# EasyEDA schematic schematic.json
TITLE: Sheet_1; REV: 1.0; Date: 2020-02-24; Sheet: 1/1; Drawn By: saikek; Company: Your Company
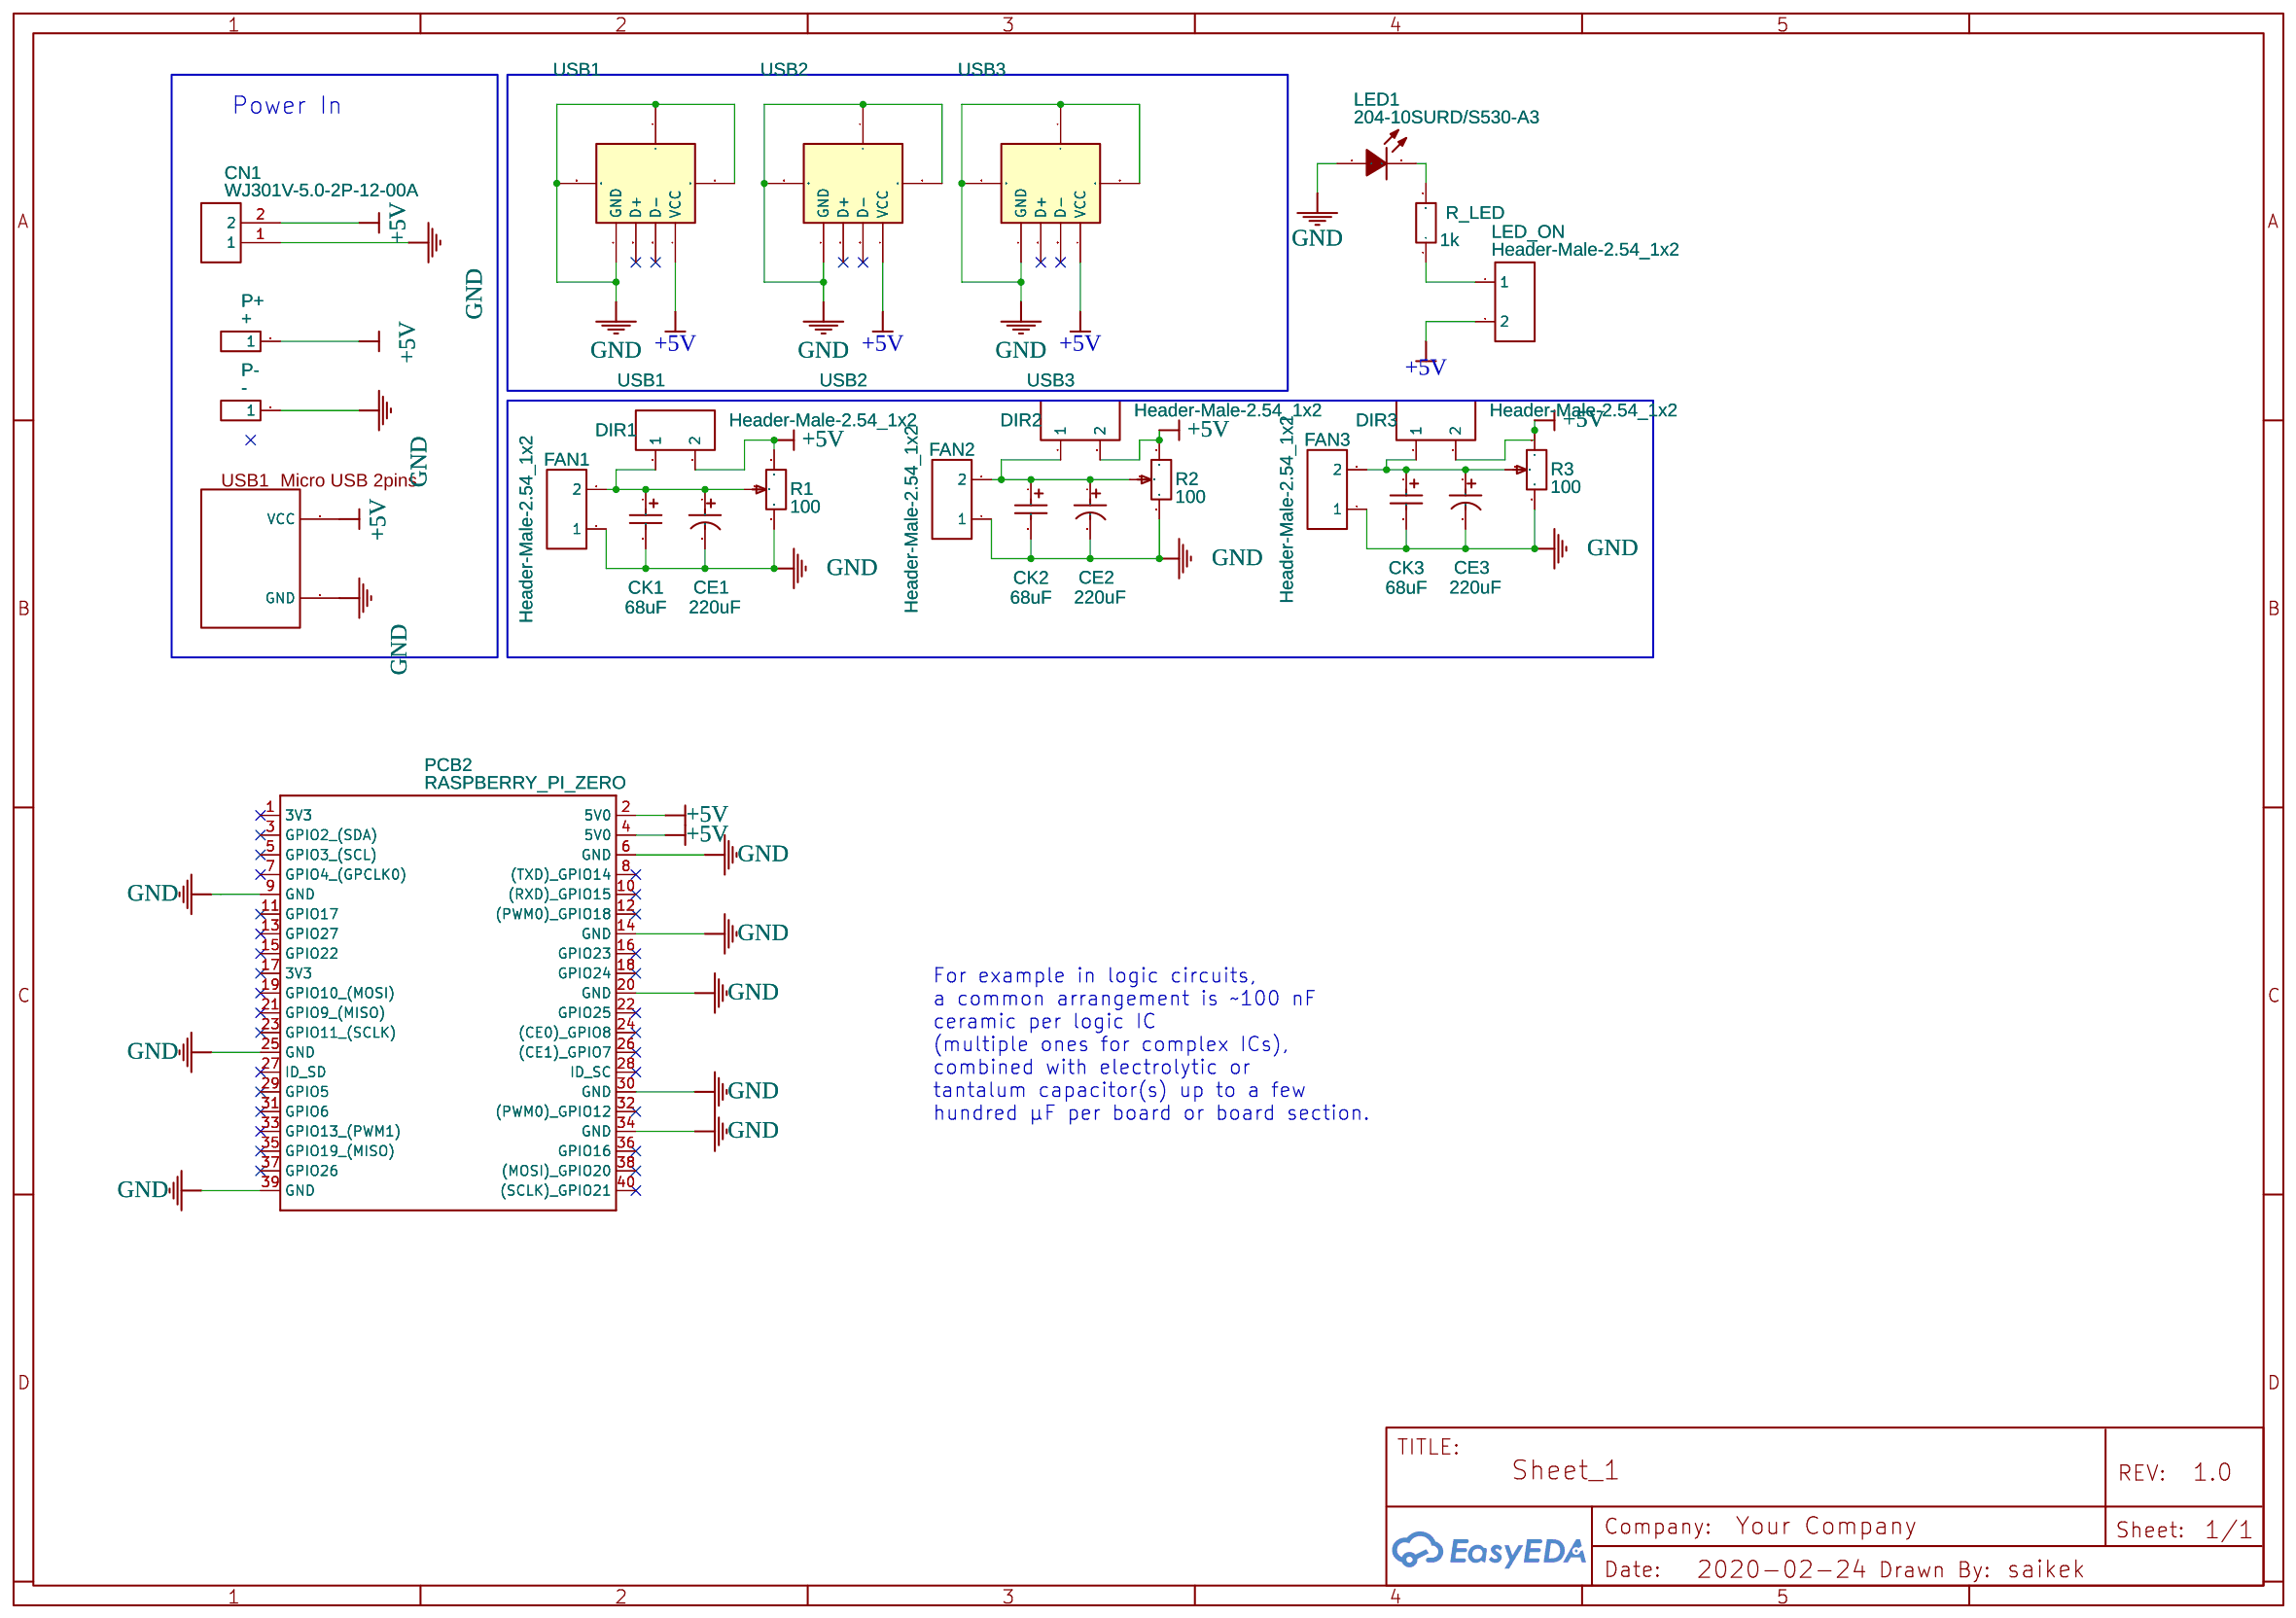
[diagram p0: schematic sheet]

## Parts
CE1  220uF  [CAP-TH_BD6.3-P2.50-D1.0-FD]
CE2  220uF  [CAP-TH_BD6.3-P2.50-D1.0-FD]
CE3  220uF  [CAP-TH_BD6.3-P2.50-D1.0-FD]
CK1  68uF  [CAP-SMD_L6.0-W3.2]
CK2  68uF  [CAP-SMD_L6.0-W3.2]
CK3  68uF  [CAP-SMD_L6.0-W3.2]
CN1  WJ301V-5.0-2P-12-00A  [WJ301V-5.0-2P-12-00A]
DIR1  Header-Male-2.54_1x2  [HDR-2X1/2.54]
DIR2  Header-Male-2.54_1x2  [HDR-2X1/2.54]
DIR3  Header-Male-2.54_1x2  [HDR-2X1/2.54]
FAN1  Header-Male-2.54_1x2  [HDR-2X1/2.54]
FAN2  Header-Male-2.54_1x2  [HDR-2X1/2.54]
FAN3  Header-Male-2.54_1x2  [HDR-2X1/2.54]
LED1  204-10SURD/S530-A3  [LED-3MM/2.54]
LED_ON  Header-Male-2.54_1x2  [HDR-2X1/2.54]
P+  +  [PAD-SMD-R150]
P-  -  [PAD-SMD-R150]
PCB2  RASPBERRY_PI_ZERO  [RASPBERRY PI ZERO (FACE UP) OUTLINE]
R1  100  [RES-ADJ-TH_3296X]
R2  100  [RES-ADJ-TH_3296X]
R3  100  [RES-ADJ-TH_3296X]
R_LED  1k  [1206]
U2  MicroUSB 2 pins female  [USB 2 PIN FEMALE]
USB1  USB1  [USB-A-TH_4P-P1.40-V-F-C39451]
USB2  USB2  [USB-A-TH_4P-P1.40-V-F-C39451]
USB3  USB3  [USB-A-TH_4P-P1.40-V-F-C39451]

## Library data of the parts
CE1-CE3 = 220uF 16V 6.3*11: Supplier: LCSC; Manufacturer: ValuePro; Supplier Part: C43349
CK1-CK3 = TAJC686K016RNJ: Supplier: LCSC; Manufacturer: AVX; Supplier Part: C7220; LCSC Assembly: Yes; SMT Type: Extend
CN1 = -: Supplier Part: C8475; Supplier: LCSC; Manufacturer: ReliaPro; Manufacturer Part: WJ301V-5.0-2P
DIR1-DIR3 FAN1-FAN3 = -: Supplier: LCSC; Manufacturer: TE Connectivity; Manufacturer Part: 826629-2; image: //image.lceda.cn/szlcsc/C86471.jpg; Supplier Part: C225488
LED1 = 204-10SURD/S530-A3: Supplier: LCSC; Manufacturer: EVERLIGHT; Supplier Part: C99772
LED_ON = Header-Male-2.54_1x2: Supplier: LCSC; Manufacturer: TE Connectivity; Manufacturer Part: 826629-2; image: //image.lceda.cn/szlcsc/C86471.jpg; Supplier Part: C86471
P+ P- = -: Supplier: LCSC; Manufacturer: ReliaPro; Manufacturer Part: Header-Male-2.54_1x1; Supplier Part: C81276
PCB2 = -: Raspberry Pi Zero; sourceId: a8qICUO6o; Manufacturer Part: ?
R1-R3 = 3296X-1-101LF: Supplier: LCSC; Manufacturer: BOURNS; Supplier Part: C92220
R_LED = Res_1206(1/4W)_EU
U2 = -: Contributor: CyberneticsCore
USB1-USB3 = AF 10.0 Side insert 3 Boundless iron PBT White plastic 90degree: Supplier: LCSC; Manufacturer: ValuePro; image: //image.lceda.cn/szlcsc/C39451.jpg; Supplier Part: C39451

## Nets
+5V: CN1.2 DIR1.2 DIR2.2 DIR3.2 LED_ON.2 P+.1 PCB2.2(5V0) PCB2.4(5V0) R1.1 R2.1 R3.1 U2.2(VCC) USB1.4(VCC) USB2.4(VCC) USB3.4(VCC)
GND: CE1.2 CE2.2 CE3.2 CK1.2 CK2.2 CK3.2 CN1.1 FAN1.1 FAN2.1 FAN3.1 LED1.1(A) P-.1 PCB2.6(GND) PCB2.9(GND) PCB2.14(GND) PCB2.20(GND) PCB2.25(GND) PCB2.30(GND) PCB2.34(GND) PCB2.39(GND) R1.3 R2.3 R3.3 U2.1(GND) USB1.1(GND) USB1.5 USB1.6 USB1.7 USB2.1(GND) USB2.5 USB2.6 USB2.7 USB3.1(GND) USB3.5 USB3.6 USB3.7
Net-(CE1-1): CE1.1 CK1.1 DIR1.1 FAN1.2 R1.2
Net-(CE2-1): CE2.1 CK2.1 DIR2.1 FAN2.2 R2.2
Net-(CE3-1): CE3.1 CK3.1 DIR3.1 FAN3.2 R3.2
Net-(LED1-2): LED1.2(K) R_LED.2
Net-(LED_ON-1): LED_ON.1 R_LED.1

Not connected (* = marked no-connect by the designer): PCB2 1(3V3)* 3(GPIO2 (SDA))* 5(GPIO3 (SCL))* 7(GPIO4 (GPCLK0))* 8((TXD) GPIO14)* 10((RXD) GPIO15)* 11(GPIO17)* 12((PWM0) GPIO18)* 13(GPIO27)* 15(GPIO22)* 16(GPIO23)* 17(3V3)* 18(GPIO24)* 19(GPIO10 (MOSI))* 21(GPIO9 (MISO))* 22(GPIO25)* 23(GPIO11 (SCLK))* 24((CE0) GPIO8)* 26((CE1) GPIO7)* 27(ID_SD)* 28(ID_SC)* 29(GPIO5)* 31(GPIO6)* 32((PWM0) GPIO12)* 33(GPIO13 (PWM1))* 35(GPIO19 (MISO))* 36(GPIO16)* 37(GPIO26)* 38((MOSI) GPIO20)* 40((SCLK) GPIO21)*; USB1 2(D+)* 3(D-)*; USB2 2(D+)* 3(D-)*; USB3 2(D+)* 3(D-)*

## Notes on the sheet
- Power In
- For example in logic circuits,
  a common arrangement is ~100 nF
  ceramic per logic IC
  (multiple ones for complex ICs),
  combined with electrolytic or
  tantalum capacitor(s) up to a few
  hundred μF per board or board section.
